# EAGLE design wctrl_star (EAGLE 7.6.0)
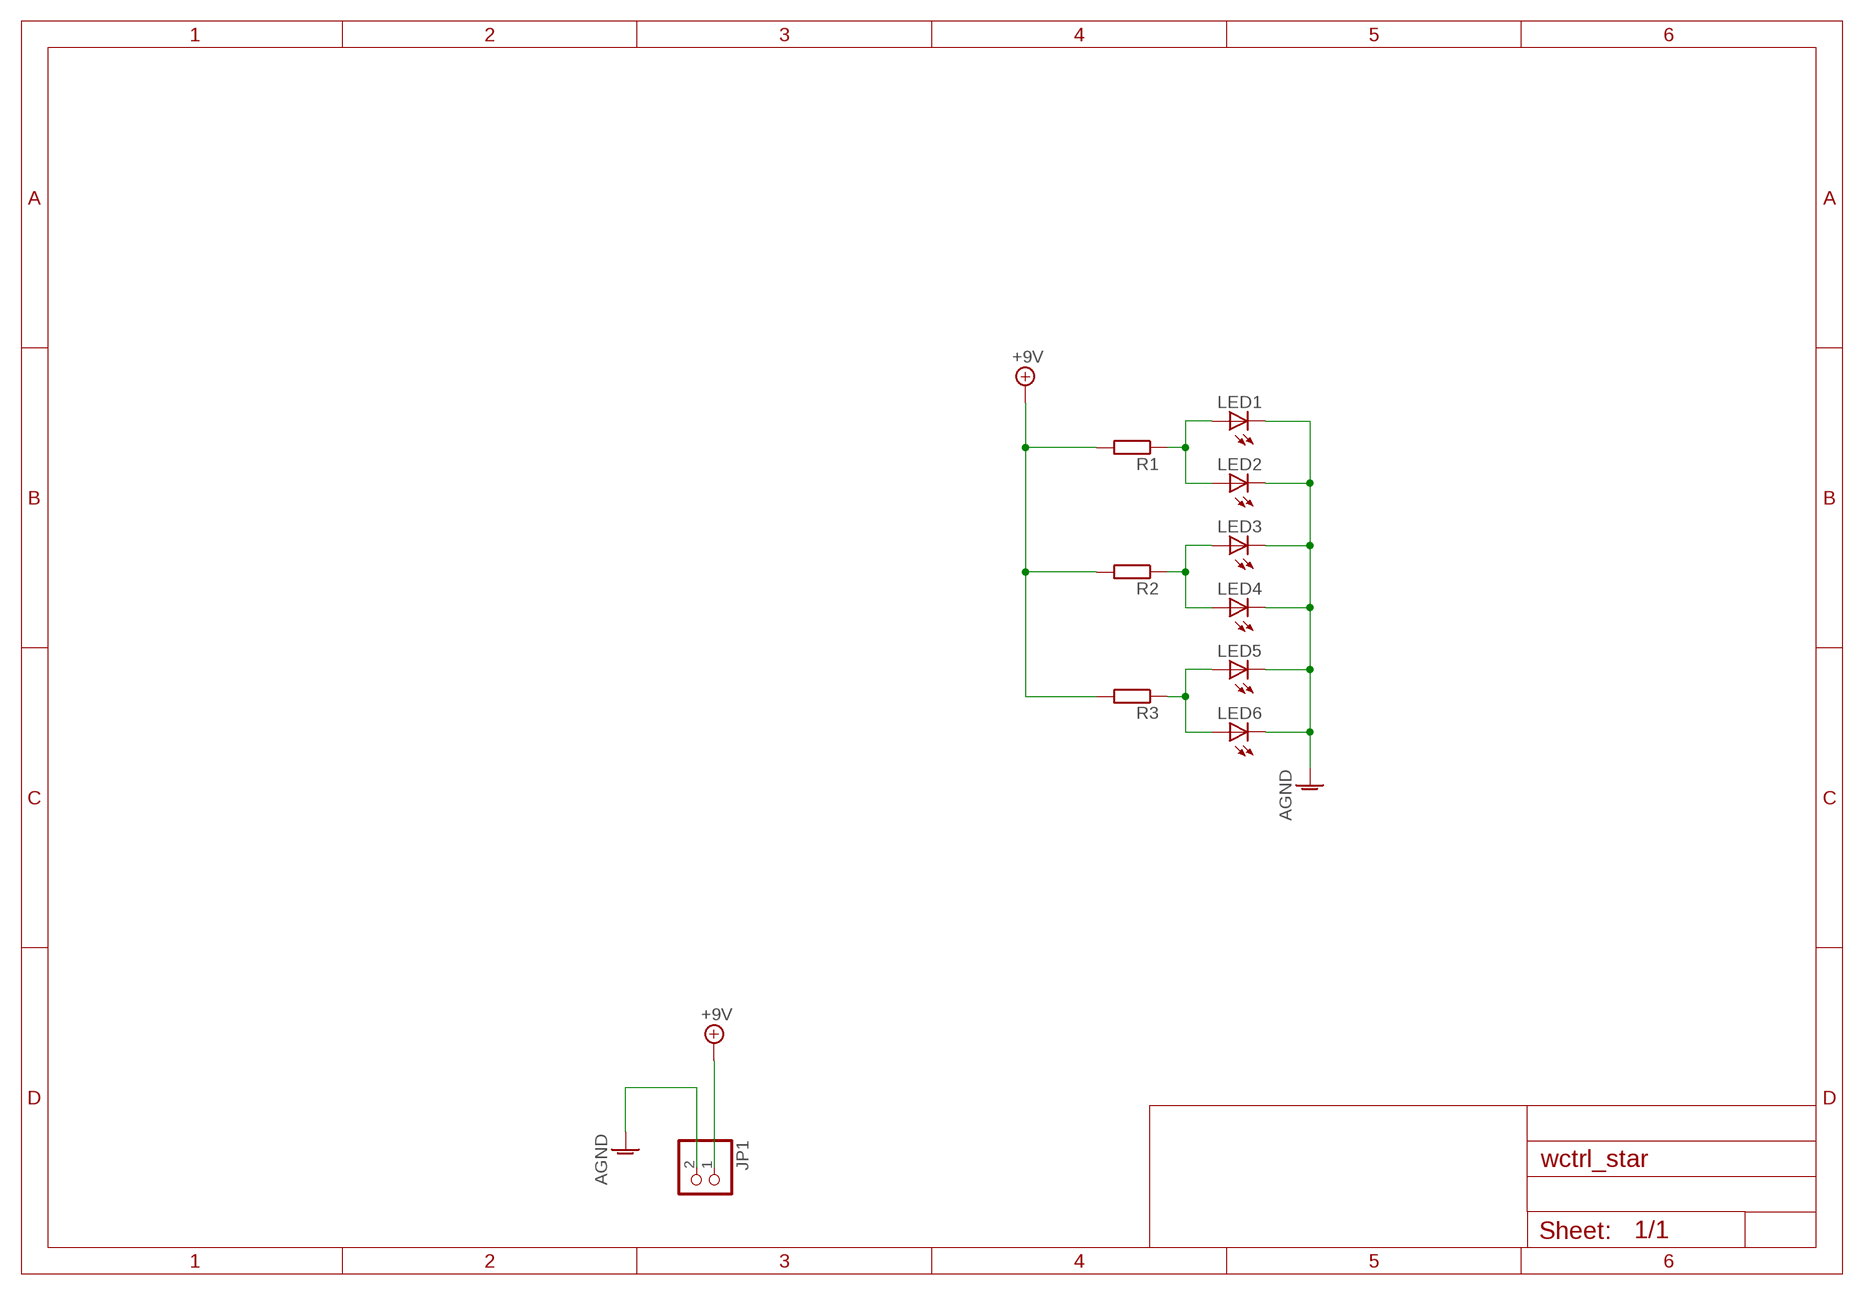
[diagram p0: schematic, sheet 1]

## Parts
JP1  PINHD-1X2  [1X02]
LED1  LED3MM  [LED3MM]
LED2  LED3MM  [LED3MM]
LED3  LED3MM  [LED3MM]
LED4  LED3MM  [LED3MM]
LED5  LED3MM  [LED3MM]
LED6  LED3MM  [LED3MM]
R1  R-EU_0207/10  [0207/10]
R2  R-EU_0207/10  [0207/10]
R3  R-EU_0207/10  [0207/10]

## Nets
+9V: JP1.1 R1.2 R2.2 R3.2
AGND: JP1.2 LED1.K(C) LED2.K(C) LED3.K(C) LED4.K(C) LED5.K(C) LED6.K(C)
N$1: LED1.A LED2.A R1.1
N$2: LED3.A LED4.A R2.1
N$3: LED5.A LED6.A R3.1

## Library data of the parts
JP1 = pinhead:PINHD-1X2: PIN HEADER
LED1-LED6 = led:LED: LED OSRAM: - CHIPLED LG R971, LG N971, LY N971, LG Q971, LY Q971, LO R971, LY R971 LH N974, LH R974 LS Q976, LO Q976, LY Q976 LO Q996 - Hyper CHIPLED LW Q18S LB Q993, LB Q99A, LB R99A - SideLED LS A670, LO A670, LY A670, LG A670, LP A670 LB A673, LV A673, LT A673, LW A673 LH A674 LY A675 LS A676, LA A676, LO A676, LY A676, LW A676 LS A679, LY A679, LG A679 - Hyper Micro SIDELED® LS Y876, LA Y876, LO Y876, LY Y876 LT Y87S - SmartLED LW L88C, LW L88S LB L89C, LB L89S, LG L890 LS L89K, LO L89K, LY L89K LS L896, LA L896, LO L896, LY L896 - TOPLED LS T670, LO T670, LY T670, LG T670, LP T670 LSG T670, LSP T670, LSY T670, LOP T670, LYG T670 LG T671, LOG T671, LSG T671 LB T673, LV T673, LT T673, LW T673 LH T674 LS T676, LA T676, LO T676, LY T676, LB T676, LH T676, LSB T676, LW T676 LB T67C, LV T67C, LT T67C, LS T67K, LO T67K, LY T67K, LW E67C LS E67B, LA E67B, LO E67B, LY E67B, LB E67C, LV E67C, LT E67C LW T67C LS T679, LY T679, LG T679 LS T770, LO T770, LY T770, LG T770, LP T770 LB T773, LV T773, LT T773, LW T773 LH T774 LS E675, LA E675, LY E675, LS T675 LS T776, LA T776, LO T776, LY T776, LB T776 LHGB T686 LT T68C, LB T68C - Hyper Mini TOPLED® LB M676 - Mini TOPLED Santana® LG M470 LS M47K, LO M47K, LY M47K Source: http://www.osram.convergy.de LUXEON: - LUMILED® LXK2-PW12-R00, LXK2-PW12-S00, LXK2-PW14-U00, LXK2-PW14-V00 LXK2-PM12-R00, LXK2-PM12-S00, LXK2-PM14-U00 LXK2-PE12-Q00, LXK2-PE12-R00, LXK2-PE12-S00, LXK2-PE14-T00, LXK2-PE14-U00 LXK2-PB12-K00, LXK2-PB12-L00, LXK2-PB12-M00, LXK2-PB14-N00, LXK2-PB14-P00, LXK2-PB14-Q00 LXK2-PR12-L00, LXK2-PR12-M00, LXK2-PR14-Q00, LXK2-PR14-R00 LXK2-PD12-Q00, LXK2-PD12-R00, LXK2-PD12-S00 LXK2-PH12-R00, LXK2-PH12-S00 LXK2-PL12-P00, LXK2-PL12-Q00, LXK2-PL12-R00 Source: www.luxeon.com KINGBRIGHT: KA-3528ASYC Source: www.kingbright.com
R1-R3 = rcl:R-EU_: RESISTOR, European symbol

## Board
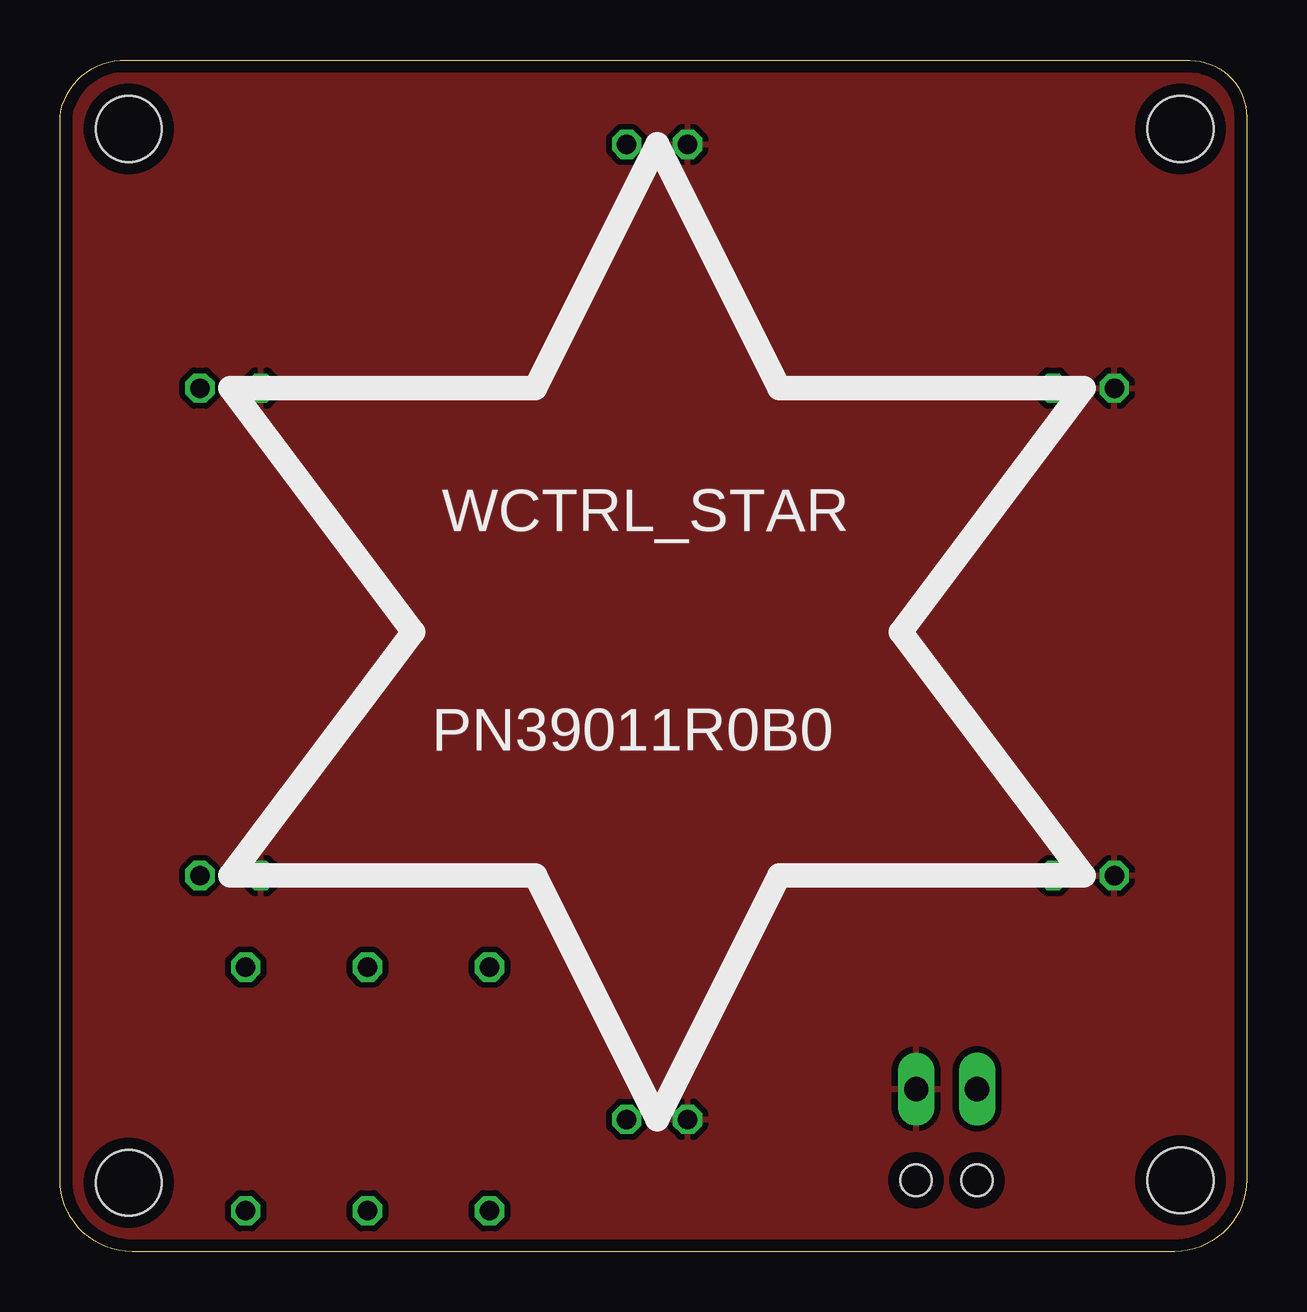
[diagram p1: board, top side]
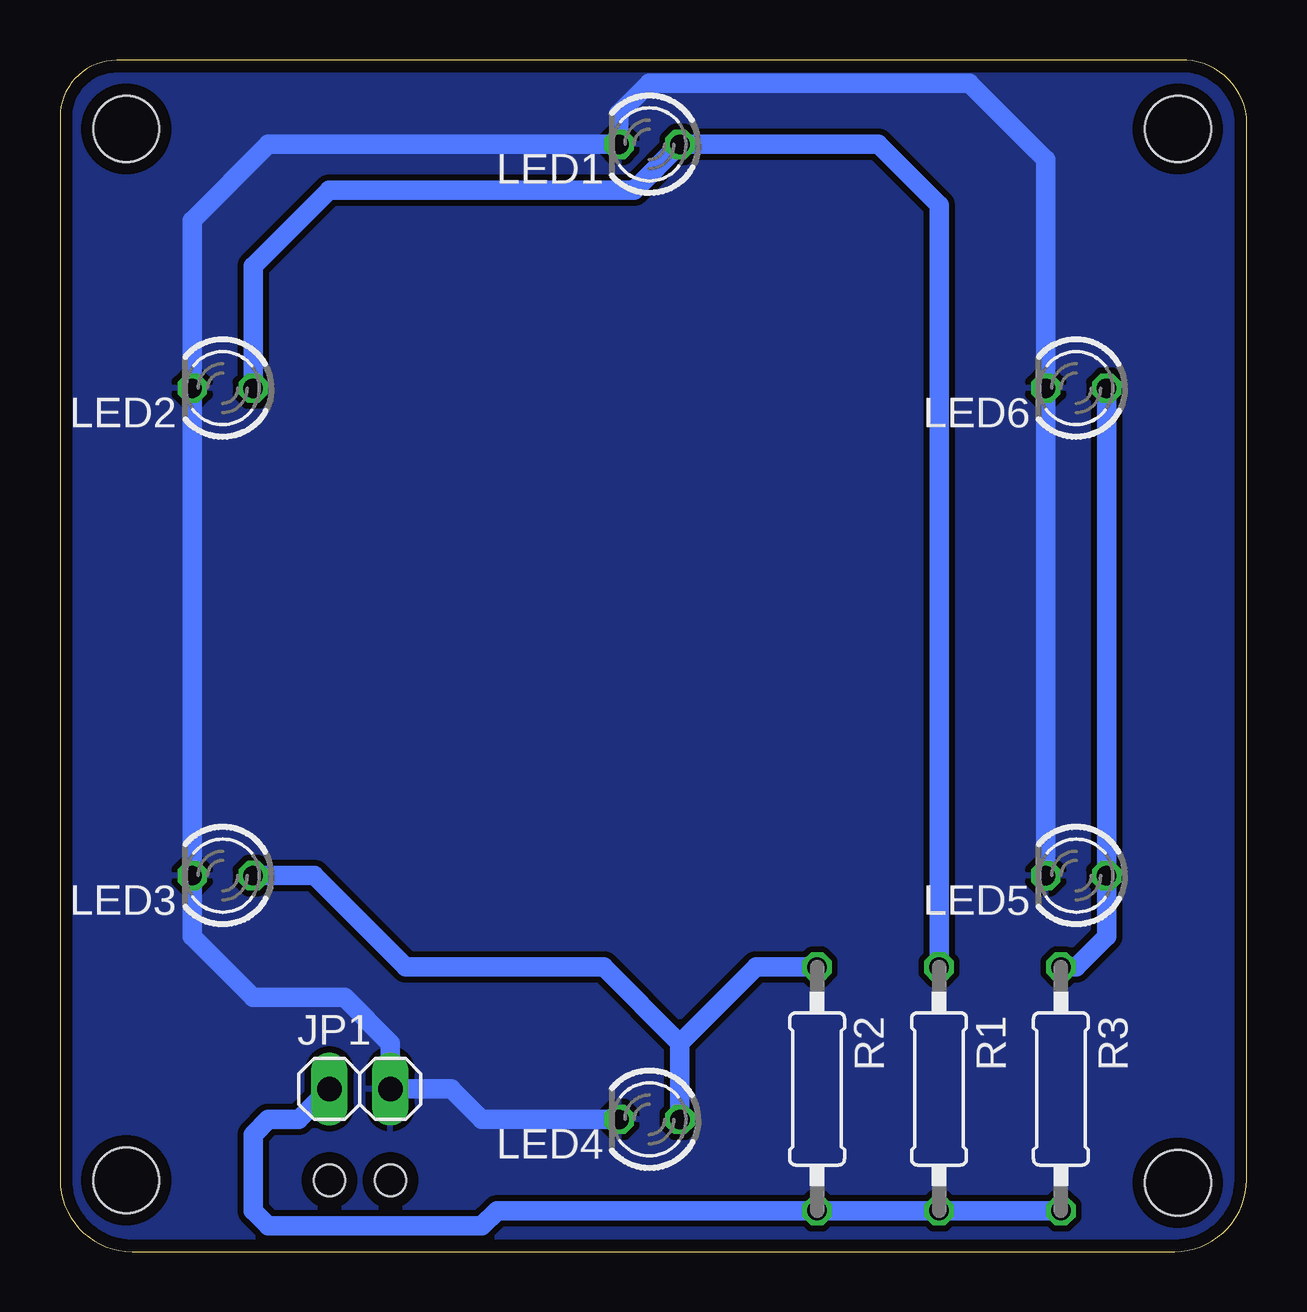
[diagram p2: board, bottom side, seen from below]

Size 49.44 x 49.67 mm. Coordinates in mm from the lower left corner, seen from the top.
Outline: 0,47.29 arc-90 3,49.65 47.07,49.65 arc-90 49.44,47.29 49.44,3 arc-90 46.44,0 3,0 arc-90 0,3 0,47.29
Copper layers (1*16): Top 0.035mm / dielectric 1.6mm / Bottom 0.035mm
Design rules "Elecrow_2-layer_PCB_eagle_rule": minimum track width 6mil, minimum drill 12mil, track to track 6mil, track to pad 6mil, pad to pad 6mil, via to via 8mil, smd to smd 0mil, copper to edge 20mil, drill to drill 10mil, minimum pad ring 6mil, minimum via ring 6mil, stop-mask expansion 0mil, vias tented up to drill 100mil, thermal gap 10mil
Holes 2.75 mm at 2.86,46.79 2.86,2.86 46.68,46.79 46.68,2.97
Holes 1.3 mm at 38.21,2.97 35.67,2.97

### Footprints (pad centres in the part's own frame; a part is rotated, then mirrored left to right if it is on the bottom)
1X02 = drill 1.016 long: 1 -1.27,0; 2 1.27,0
LED3MM = drill 0.813 octagon: A -1.27,0; K 1.27,0
0207/10 = drill 0.813 octagon: 1 -5.08,0; 2 5.08,0

### Placement (x,y rotation side)
JP1  36.95,6.78 0 bottom
LED1  24.88,46.15 180 bottom
LED2  42.66,35.99 180 bottom
LED3  42.66,15.67 180 bottom
LED4  24.88,5.51 180 bottom
LED5  7.1,15.67 180 bottom
LED6  7.1,35.99 180 bottom
R1  12.81,6.78 270 bottom
R2  17.89,6.78 270 bottom
R3  7.73,6.78 270 bottom

### Tracks (layer width: path | path; a pad name or v marks a point on that pad's centre or on a via)
+9V
  Bottom 0.813: R3.2 R1.2 R2.2 31.23,1.7 31.86,1.07 40.75,1.07 41.39,1.7 41.39,4.87 40.75,5.51 39.48,5.51 JP1.1
AGND
  Bottom 0.813: LED4.K 31.86,5.51 33.13,6.78 JP1.2 35.67,8.68 37.58,10.59 41.39,10.59 43.93,13.13 LED3.K LED2.K 43.93,42.98 40.75,46.15 LED1.K 26.15,47.42 24.88,48.69 11.54,48.69 8.37,45.52 LED6.K LED5.K
  pour Bottom (isolate 0.254): 0.11,46.79 arc-90 3.29,49.96 4.56,49.96 47.1,49.96 arc-90 49.64,47.42 49.64,46.79 49.64,2.33 arc-90 47.1,-0.21 45.84,-0.21 2.65,-0.21 arc-90 0.11,2.33 0.11,2.97
  pour Top (isolate 0.254): 0.11,46.79 arc-90 3.29,49.96 3.93,49.96 47.1,49.96 arc-90 49.64,47.42 49.64,46.79 49.64,2.97 arc-90 46.47,-0.21 45.84,-0.21 3.29,-0.21 arc-90 0.11,2.97 0.11,3.6
N$1
  Bottom 0.813: LED2.A 41.39,41.07 38.21,44.25 25.52,44.25 LED1.A 15.35,46.15 12.81,43.61 R1.1
N$2
  Bottom 0.813: R2.1 20.44,11.86 23.61,8.68 | LED4.A 23.61,8.68 | 23.61,8.68 26.79,11.86 35.04,11.86 38.85,15.67 LED3.A
N$3
  Bottom 0.813: R3.1 7.1,11.86 5.83,13.13 LED5.A LED6.A

### Text on the board
tNames: WCTRL_STAR | PN39011R0B0
tTest: GND | SDA | SCL | INTB | INTA | 3.3V | 3.3Ve | 5V | 5Ve